# Altium project Pet_Tracker_MB_Test.PrjPcb
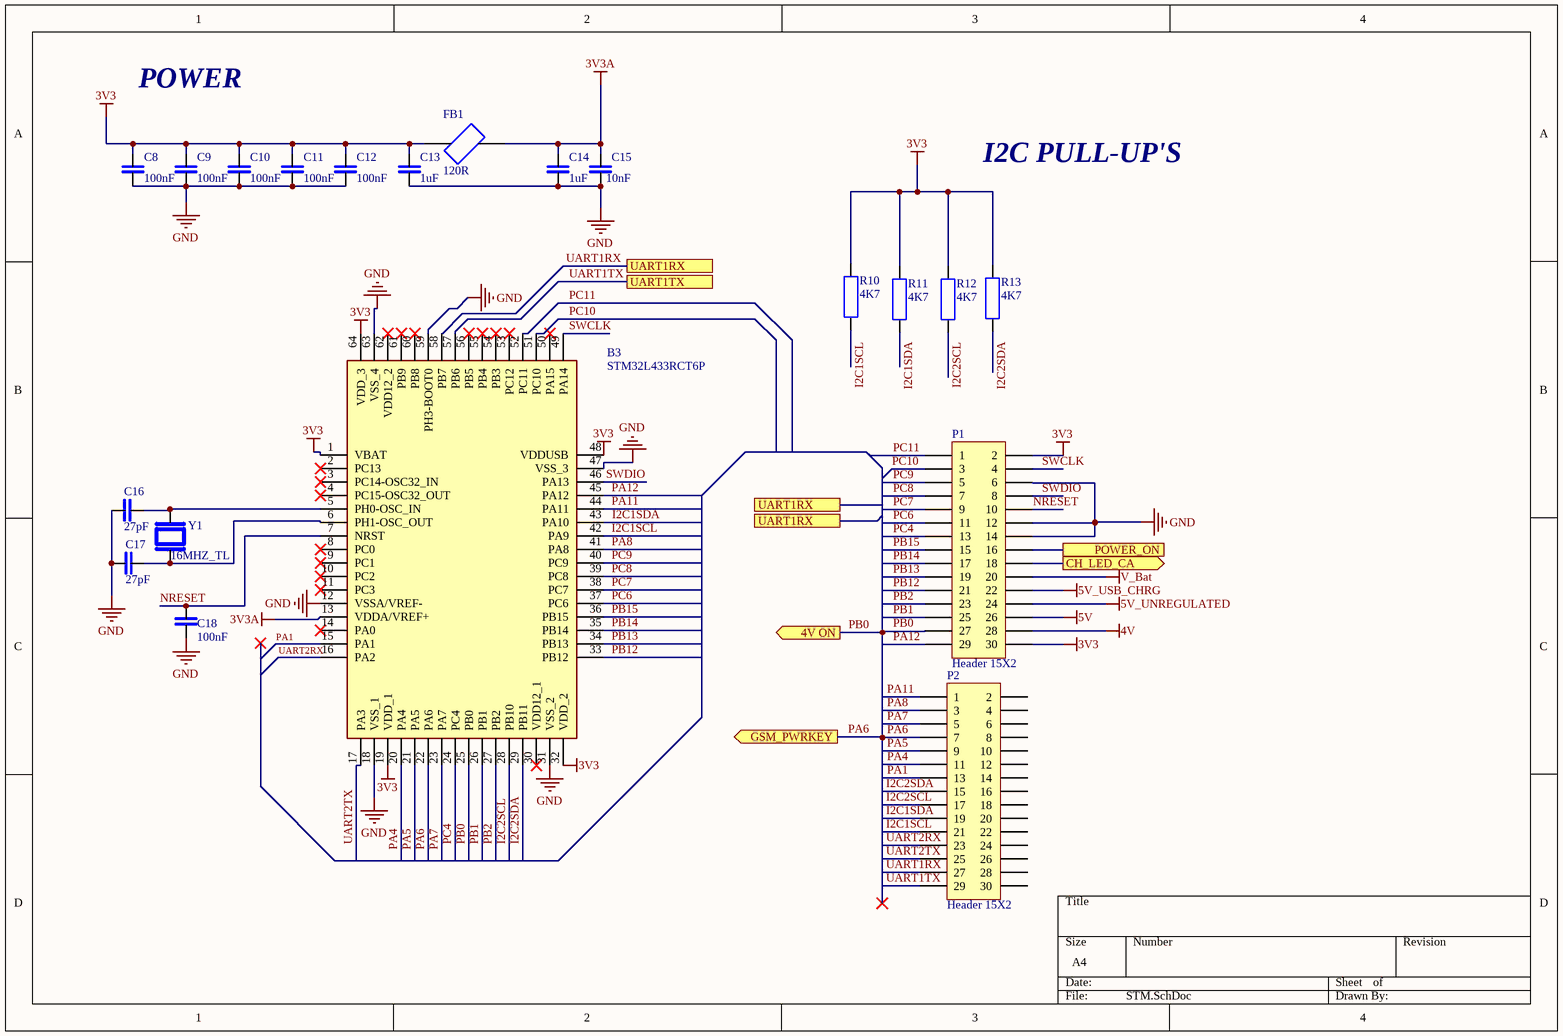
[diagram p0: STM.SchDoc]
2 sheets, 49 parts. Net scope: flat (ports and power ports of the same name join across sheets).
Board file: Pet_Tracker_MB_Test.PcbDoc
Sheets:
  STM.SchDoc
  Power_Schematic.SchDoc

## Sheet STM.SchDoc
size A4; SheetNumber: 1; SheetTotal: 2

### Parts
B3  STM32L433RCT6P  [STM32L433RCT6P]
C8  100nF  [CAP_0805]
C9  100nF  [CAP_0805]
C10  100nF  [CAP_0805]
C11  100nF  [CAP_0805]
C12  100nF  [CAP_0805]
C13  1uF  [CAP_0805]
C14  1uF  [CAP_0805]
C15  10nF  [CAP_0805]
C16  27pF  [CAP_0805]
C17  27pF  [CAP_0805]
C18  100nF  [CAP_0805]
FB1  120R  [FER_BEAD_0805]
P1  Header 15X2  [HDR2X15]
P2  Header 15X2  [HDR2X15]
R10  4K7  [RES_0805]
R11  4K7  [RES_0805]
R12  4K7  [RES_0805]
R13  4K7  [RES_0805]
Y1  16MHZ_TL  [16MHZ_TL]

### Ports
4V ON (out), CH_LED_CA (out), GSM_PWRKEY (out), POWER_ON, UART1RX, UART1TX

### Nets
3V3: B3.1(VBAT) B3.19(VDD_1) B3.32(VDD_2) B3.48(VDDUSB) B3.64(VDD_3) C8.2 C9.2 C10.2 C11.2 C12.2 C13.2 FB1.1 P1.2 P1.30 R10.2 R11.2 R12.2 R13.2
3V3A: B3.13(VDDA/VREF+) C14.2 C15.2 FB1.2
4V: P1.28
5V: P1.26
5V_UNREGULATED: P1.24
5V_USB_CHRG: P1.22
GND: B3.12(VSSA/VREF-) B3.18(VSS_1) B3.31(VSS_2) B3.47(VSS_3) B3.59(PH3-BOOT0) B3.63(VSS_4) C8.1 C9.1 C10.1 C11.1 C12.1 C13.1 C14.1 C15.1 C16.2 C17.1 C18.1 P1.6 P1.12 P1.14
V_Bat: P1.20
CHARGE_LED_CATH: P1.18 ; port CH_LED_CA
I2C1SCL: B3.42(PA9) P2.21 R10.1
I2C1SDA: B3.43(PA10) P2.19 R11.1
I2C2SCL: B3.28(PB10) P2.17 R12.1
I2C2SDA: B3.29(PB11) P2.15 R13.1
NRESET: B3.7(NRST) C18.2 P1.10
PA1: B3.15(PA1) P2.13
PA4: B3.20(PA4) P2.11
PA5: B3.21(PA5) P2.9
PA6: B3.22(PA6) P2.7 ; port GSM_PWRKEY
PA7: B3.23(PA7) P2.5
PA8: B3.41(PA8) P2.3
PA11: B3.44(PA11) P2.1
PA12: B3.25(PB0) B3.45(PA12) P1.27 P1.29 ; port 4V ON  [also labelled PB0]
PB1: B3.26(PB1) P1.25
PB2: B3.27(PB2) P1.23
PB12: B3.33(PB12) P1.21
PB13: B3.34(PB13) P1.19
PB14: B3.35(PB14) P1.17
PB15: B3.36(PB15) P1.15
PC4: B3.24(PC4) P1.13
PC6: B3.37(PC6) P1.11
PC7: B3.38(PC7) P1.9
PC8: B3.39(PC8) P1.7
PC9: B3.40(PC9) P1.5
PC10: B3.51(PC10) P1.3
PC11: B3.52(PC11) P1.1
SWCLK: B3.49(PA14) P1.4
SWDIO: B3.46(PA13) P1.8
UART1RX: B3.58(PB7) P2.27 ; port UART1RX
UART1TX: B3.57(PB6) P2.29 ; port UART1TX
UART2RX: B3.16(PA2) P2.23
UART2TX: B3.17(PA3) P2.25
NetB3_5: B3.5(PH0-OSC_IN) C16.1 Y1.2
NetB3_6: B3.6(PH1-OSC_OUT) C17.2 Y1.1
NetC7_2: P1.16 ; port POWER_ON

Not connected (* = marked no-connect by the designer): B3 2(PC13)* 3(PC14-OSC32_IN)* 4(PC15-OSC32_OUT)* 8(PC0)* 9(PC1)* 10(PC2)* 11(PC3)* 14(PA0)* 30(VDD12_1)* 50(PA15)* 53(PC12)* 54(PB3)* 55(PB4)* 56(PB5)* 60(PB8)* 61(PB9)* 62(VDD12_2)*; P2 2 4 6 8 10 12 14 16 18 20 22 24 26 28 30

### Notes on the sheet
- POWER
- I2C PULL-UP'S
- Labels drawn without touching a wire or pin: PB0

### Library data of the parts
B3 = STM32L433RCT6P: ARM Cortex-M4 MCU 80 MHz with 256 Kbyte; Manufacturer_Name: STMicroelectronics; Geometry.Height: 1.6mm; Manufacturer_Part_Number: STM32L433RCT6P; Mouser Part Number: 511-STM32L433RCT6P; Mouser Price/Stock: https://www.mouser.co.uk/ProductDetail/STMicroelectronics/STM32L433RCT6P?qs=5aG0NVq1C4w37CrDvhaloQ%3D%3D; Arrow Part Number: STM32L433RCT6P; Arrow Price/Stock: https://www.arrow.com/en/products/stm32l433rct6p/stmicroelectronics?region=nac; Datasheet Link: https://www.mouser.com/datasheet/2/389/stm32l433cc-956250.pdf
C8-C18 = SMT_CAP: MP: LD051A270KAB2A; Package: None; Price: None; Availability: Unavailable
FB1 = SMT_FER_BEAD: 1 kOhms @ 100MHz 1 1.5A 150mOhm; MF: TDK; MP: MPZ2012S102ATD25; Check_prices: https://www.snapeda.com/parts/MPZ2012S102ATD25/TDK/view-part/2724083/?ref=eda; Availability: Good; Price: None; SnapEDA_Link: https://www.snapeda.com/parts/MPZ2012S102ATD25/TDK/view-part/2724083/?ref=snap; Value: *; Package: 0805 TDK; Purchase-URL: https://pricing.snapeda.com/search/part/MPZ2012S102ATD25/?ref=eda
P1 P2 = Header 15X2: Header, 15-Pin, Dual row; LatestRevisionDate: 17-Jul-2002; LatestRevisionNote: Re-released for DXP Platform.; Publisher: Altium Limited
R10-R13 = SMT_RES: Power_Rating: .25 W; MP: 2-2176053-0; Tolerance: 1%; Resistance: .33; MF: TE Connectivity; Price: None; Availability: In Stock; EU_RoHS_Compliance: Compliant with Exemptions; Package: 0805; Value: *; SnapEDA_Link: https://www.snapeda.com/parts/2-2176053-0/TE+Connectivity/view-part/?ref=snap; Check_prices: https://www.snapeda.com/parts/2-2176053-0/TE+Connectivity/view-part/?ref=eda
Y1 = 16MHZ_TL: 16MHz Â±30ppm Crystal 18pF 40 Ohms HC-49/US; MF: Abracon LLC; MP: ABL-16.000MHz-B4Y; Package: HC-49/US ABRACON; Price: None; Purchase-URL: https://pricing.snapeda.com/search/part/ABL-16.000MHz-B4Y/?ref=eda; Check_prices: https://www.snapeda.com/parts/ABL-16.000MHz-B4Y/Abracon+LLC/view-part/?ref=eda; Value: *; SnapEDA_Link: https://www.snapeda.com/parts/ABL-16.000MHz-B4Y/Abracon+LLC/view-part/?ref=snap; Availability: In Stock

## Sheet Power_Schematic.SchDoc
size 300 x 200 mm; SheetNumber: 2; SheetTotal: 2
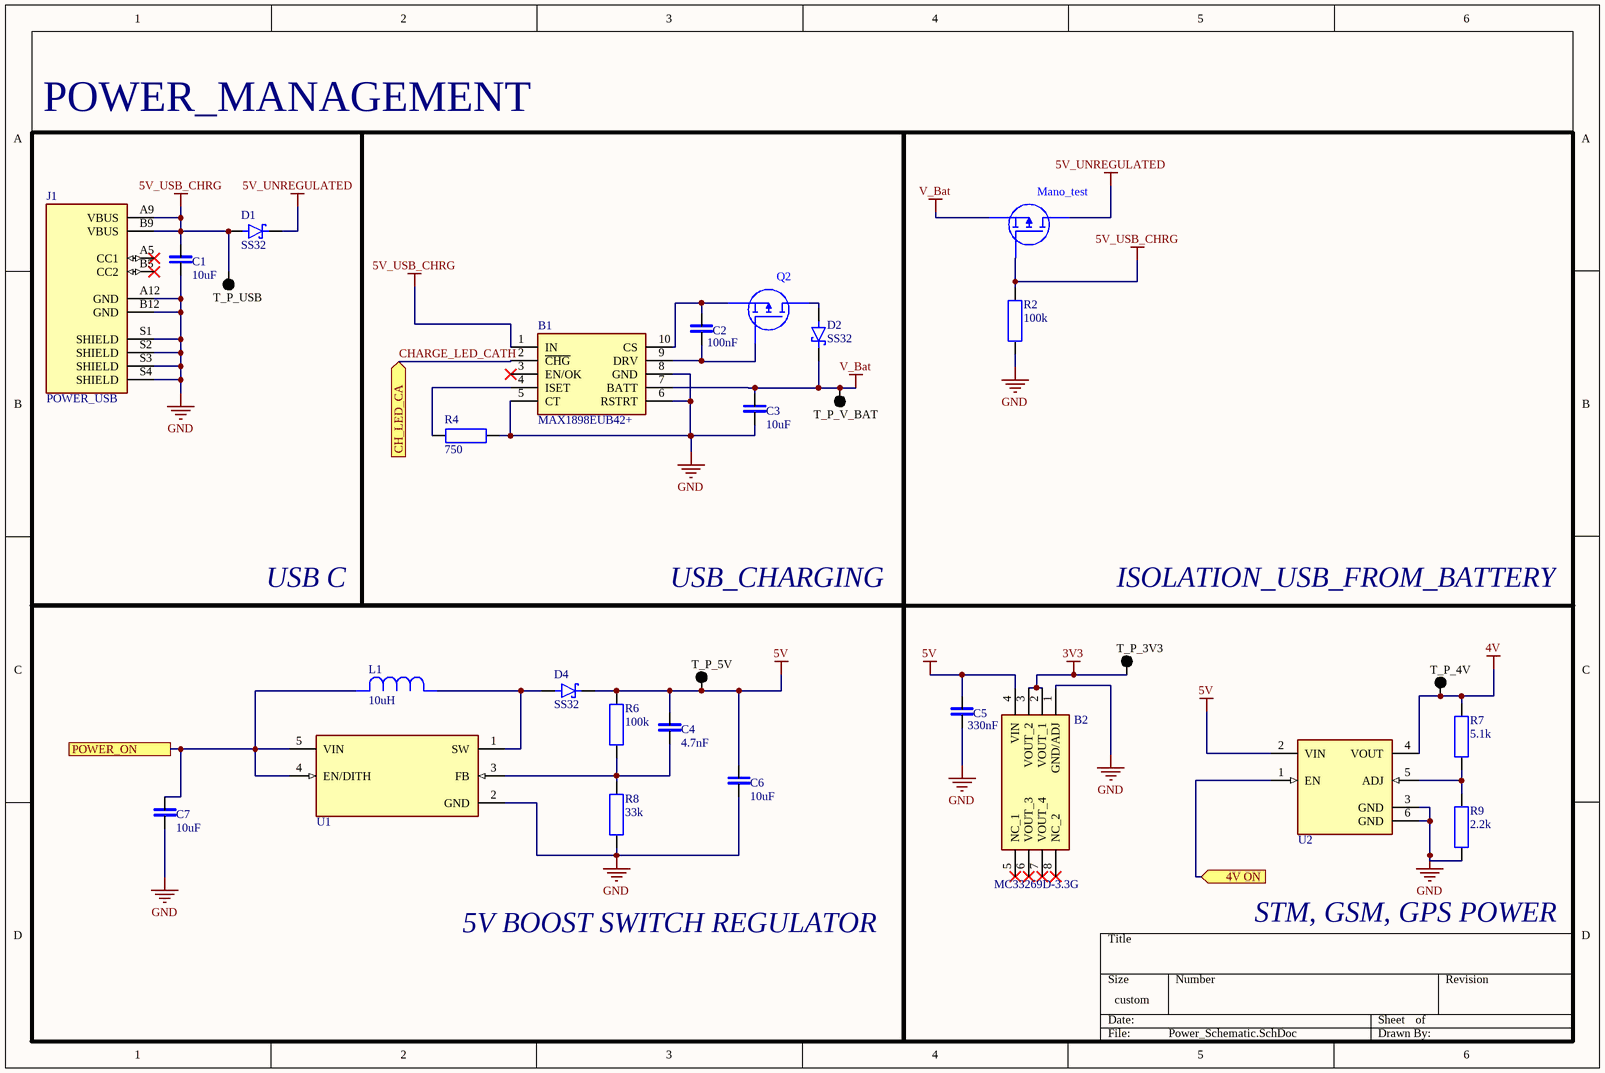
[diagram p1: Power_Schematic.SchDoc]

### Parts
B1  MAX1898EUB42+  [MAX1898EUB42]
B2  MC33269D-3.3G  [3V3Voltage_MC33269D-3.3G]
C1  10uF  [CAP_0805]
C2  100nF  [CAP_0805]
C3  10uF  [CAP_0805]
C4  4.7nF  [CAP_0805]
C5  330nF  [CAP_0805]
C6  10uF  [CAP_0805]
C7  10uF  [CAP_0805]
D1  SS32  [POWER_SCHOTKY_3A]
D2  SS32  [POWER_SCHOTKY_3A]
D4  SS32  [POWER_SCHOTKY_3A]
J1  POWER_USB  [POWER_USB_C]
L1  10uH  [MCSD54-4R7MU]
Mano_test  MOSFET Pch -45V -4.5A  [P_CHANNEL_POWER_RD3H045SPTL1]  (value not drawn)
Q2  MOSFET Pch -45V -4.5A  [P_CHANNEL_POWER_RD3H045SPTL1]  (value not drawn)
R2  100k  [RES_0805]
R4  750  [RES_0805]
R6  100k  [RES_0805]
R7  5.1k  [RES_0805]
R8  33k  [RES_0805]
R9  2.2k  [RES_0805]
TP_3V3  T_P_3V3  [T_P]  (net tie, no BOM)
TP_4V  T_P_4V  [T_P]  (net tie, no BOM)
TP_5V  T_P_5V  [T_P]  (net tie, no BOM)
TP_USB  T_P_USB  [T_P]  (net tie, no BOM)
TP_V_BAT?  T_P_V_BAT  [T_P]  (net tie, no BOM)
U1  Switch Voltage Regulator MIC2250-1YD5-TR  [Switching_MIC2250-1YD5-TR]  (value not drawn)
U2  1.24V-5V MIC37252WR  [1V24_5V_MIC37252WR]  (value not drawn)

### Blocks framed on the sheet
POWER_MANAGEMENT: B1 C1-C3 D1 D2 J1 Q2 R4 TP_USB TP_V_BAT?

### Ports
4V ON (in), CH_LED_CA (in), POWER_ON

### Nets
3V3: B2.2(VOUT_1) B2.3(VOUT_2) TP_3V3.1
4V: R7.2 TP_4V.1 U2.4(VOUT)
5V: B2.4(VIN) C4.2 C5.2 C6.2 D4.C(K) R6.2 TP_5V.1 U2.2(VIN)
5V_UNREGULATED: D1.C(K) Mano_test.2(D)
5V_USB_CHRG: B1.1(IN) C1.2 D1.A J1.A9(VBUS) J1.B9(VBUS) Mano_test.1(G) R2.2 TP_USB.1
GND: B1.5(CT) B1.6(RSTRT) B1.8(GND) B2.1(GND/ADJ) C1.1 C3.1 C5.1 C6.1 C7.1 J1.A12(GND) J1.B12(GND) J1.S1(SHIELD) J1.S2(SHIELD) J1.S3(SHIELD) J1.S4(SHIELD) R2.1 R4.2 R8.1 R9.1 U1.2(GND) U2.3(GND) U2.6(GND)
V_Bat: B1.7(BATT) C3.2 D2.C(K) Mano_test.3(S) TP_V_BAT?.1
CHARGE_LED_CATH: B1.2(~{CHG}) ; port CH_LED_CA
PA12: U2.1(EN) ; port 4V ON
NetB1_4: B1.4(ISET) R4.1
NetB1_9: B1.9(DRV) C2.1 Q2.1(G)
NetB1_10: B1.10(CS) C2.2 Q2.3(S)
NetC4_1: C4.1 R6.1 R8.2 U1.3(FB)
NetC7_2: C7.2 L1.2 U1.4(EN/DITH) U1.5(VIN) ; port POWER_ON
NetD2_A: D2.A Q2.2(D)
NetD4_A: D4.A L1.1 U1.1(SW)
NetR7_1: R7.1 R9.2 U2.5(ADJ)

Not connected (* = marked no-connect by the designer): B1 3(EN/OK)*; B2 5(NC_1)* 6(VOUT_3)* 7(VOUT_4)* 8(NC_2)*; J1 A5(CC1)* B5(CC2)*

### Notes on the sheet
- USB C
- USB_CHARGING
- ISOLATION_USB_FROM_BATTERY
- 5V BOOST SWITCH REGULATOR
- STM, GSM, GPS POWER

### Library data of the parts
B1 = MAX1898EUB42+: Part: MAX1898EUB42+ BATT CHARGER, LI-ION, 4.2V; Manufacturer_Name: Analog Devices; Geometry.Height: 1.1mm; Manufacturer_Part_Number: MAX1898EUB42+; Mouser Part Number: 700-MAX1898EUB42; Mouser Price/Stock: https://www.mouser.co.uk/ProductDetail/Maxim-Integrated/MAX1898EUB42%2b?qs=LHmEVA8xxfaFlPLqK8C6rw%3D%3D; Arrow Part Number: MAX1898EUB42+; Arrow Price/Stock: https://www.arrow.com/en/products/max1898eub42/maxim-integrated?region=nac; Datasheet Link: https://datasheets.maximintegrated.com/en/ds/MAX1898.pdf
B2 = LDO3V3: Voltage regulator,Part: MC33269D-3.3G, Low Dropout Voltage Regulator, 0.8A 3.3; Manufacturer_Name: onsemi; Geometry.Height: 1.75mm; Manufacturer_Part_Number: MC33269D-3.3G; Mouser Part Number: 863-MC33269D-3.3G; Mouser Price/Stock: https://www.mouser.co.uk/ProductDetail/onsemi/MC33269D-33G?qs=dFKnUM%2FquJZ%252BBcrN2hd5Yg%3D%3D; Arrow Part Number: MC33269D-3.3G; Arrow Price/Stock: https://www.arrow.com/en/products/mc33269d-3.3g/on-semiconductor?region=europe; Datasheet Link: http://www.onsemi.com/pub/Collateral/MC33269-D.PDF
C1-C7 = SMT_CAP: MP: LD051A270KAB2A; Package: None; Price: None; Availability: Unavailable
D1 D2 D4 = POWER_SCHOTKY_3A: Part: SS32; MF: ON Semiconductor; Value: *; Price: None; Package: SMC-2 ON Semiconductor; Check_prices: https://www.snapeda.com/parts/SS32/Onsemi/view-part/?ref=eda; Purchase-URL: https://pricing.snapeda.com/search/part/SS32/?ref=eda; SnapEDA_Link: https://www.snapeda.com/parts/SS32/Onsemi/view-part/?ref=snap; Availability: In Stock; MP: SS32
J1 = POWER_USB: USB_C_ONLY_POWER / https://lt.farnell.com/gct-global-connector-technology/usb4125-gf-a/usb-conn-2-0-type-c-r-a-rcpt-6pos/dp/3648642; MP: USB4125-GF-A_REVA2; Package: None; Availability: Unavailable; Value: *; Price: None
L1 = IND: Part: MCSD54-4R7MU; Mfr_Name: Multicomp; Copyright: Copyright (C) 2023 Ultra Librarian. All rights reserved.; Manufacturer_Part_Number: MCSD54-4R7MU
Mano_test Q2 = P_CHANNEL_POWER 4.5A RD3H045SPTL1: Part: RD3H045SPTL1; Manufacturer_Name: ROHM Semiconductor; GateName_1: G$1; SymbolName_1: RD3H045SPTL1; LibraryName: RD3H045SPTL1; DeviceSetName: RD3H045SPTL1; Package: RD3P175SNFRATL; Manufacturer_Part_Number: RD3H045SPTL1; Mouser_Part_Number: 755-RD3H045SPTL1; Mouser_Price-Stock: https://www.mouser.co.uk/ProductDetail/ROHM-Semiconductor/RD3H045SPTL1?qs=W0yvOO0ixfGBWnxPdnIMog%3D%3D; Height: mm
R2 R4 R6-R9 = SMT_RES: as R10 on sheet STM; Price: None; Availability: In Stock; EU_RoHS_Compliance: Compliant with Exemptions; Package: 0805; Value: *; SnapEDA_Link: https://www.snapeda.com/parts/2-2176053-0/TE+Connectivity/view-part/?ref=snap; Check_prices: https://www.snapeda.com/parts/2-2176053-0/TE+Connectivity/view-part/?ref=eda
TP_3V3 TP_4V TP_5V TP_USB TP_V_BAT? = T_P: Test_point
U1 = Switch Voltage Regulator MIC2250-1YD5-TR: Part: MIC2250-1YD5-TR / 2.5V to 5.5 V input / 1.24V to 32V output
U2 = 1.24V-5V MIC37252WR: Part: MIC37252WR

## Nets that join several sheets
3V3: STM (18 pins), Power_Schematic (B2.2 B2.3 TP_3V3.1)
4V: STM (P1.28), Power_Schematic (R7.2 TP_4V.1 U2.4)
5V: STM (P1.26), Power_Schematic (8 pins)
5V_UNREGULATED: STM (P1.24), Power_Schematic (D1.C Mano_test.2)
5V_USB_CHRG: STM (P1.22), Power_Schematic (8 pins)
GND: STM (20 pins), Power_Schematic (22 pins)
V_Bat: STM (P1.20), Power_Schematic (5 pins)
CHARGE_LED_CATH: STM (P1.18), Power_Schematic (B1.2)
NetC7_2: STM (P1.16), Power_Schematic (C7.2 L1.2 U1.4 U1.5)
PA12: STM (B3.25 B3.45 P1.27 P1.29), Power_Schematic (U2.1)